# Altium schematic sheet [01] Power Supply.SchDoc
size A4
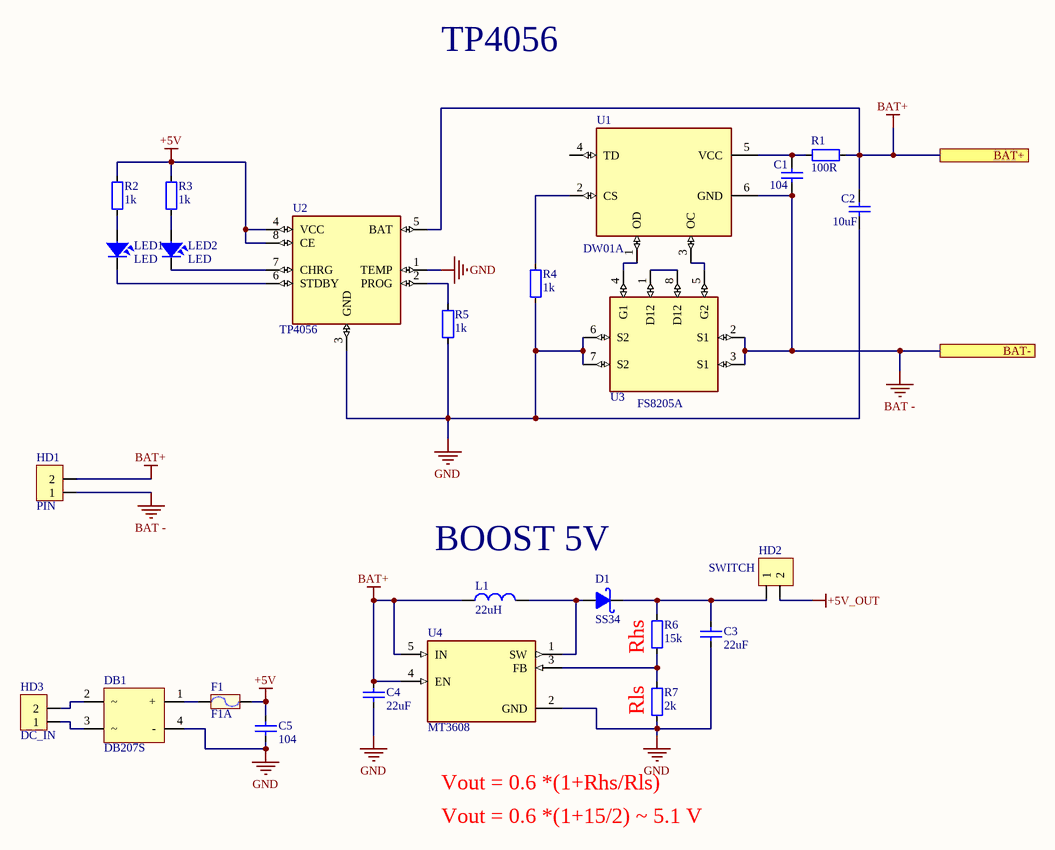
[diagram p0: [01] Power Supply.SchDoc]

## Parts
C1  104  [CAP_0805]
C2  10uF  [CAP_0805]
C3  22uF  [CAP_1206]
C4  22uF  [CAP_1206]
C5  104  [CAP_0805]
D1  SS34  [DO-214AA]
DB1  DB207S  [DB207S]
F1  F1A  [RES-SMD-1812]
HD1  PIN  [HED2T]
HD2  SWITCH  [HED2T]
HD3  DC_IN  [HED2T]
L1  22uH  [CD75-220]
LED1  LED  [LED-0805-Green]
LED2  LED  [LED-0805-Red]
R1  100R  [RES-SMD-0805]
R2  1k  [RES-SMD-0805]
R3  1k  [RES-SMD-0805]
R4  1k  [RES-SMD-0805]
R5  1k  [RES-SMD-0805]
R6  15k  [RES-SMD-0805]
R7  2k  [RES-SMD-0805]
U1  DW01A  [SOT23-6]
U2  TP4056  [TP4056]
U3  FS8205A  [FS8205A]
U4  MT3608  [MT3608]

## Ports
BAT+, BAT-

## Nets
+5V: C5.2 F1.2 R2.2 R3.2 U2.4(VCC) U2.8(CE)
+5V_OUT: HD2.2
BAT -: C1.1 HD1.1 U1.6(GND) U3.2(S1) U3.3(S1) ; port BAT-
BAT+: C2.2 C4.2 HD1.2 L1.1 R1.1 U2.5(BAT) U4.4(EN) U4.5(IN) ; port BAT+
GND: C2.1 C3.1 C4.1 C5.1 DB1.4(-) R4.1 R5.1 R7.1 U2.1(TEMP) U2.3(GND) U3.6(S2) U3.7(S2) U4.2(GND)
NetC1_2: C1.2 R1.2 U1.5(VCC)
NetC3_2: C3.2 D1.2(K) HD2.1 R6.2
NetD1_1: D1.1(A) L1.2 U4.1(SW)
NetDB1_1: DB1.1(+) F1.1
NetDB1_2: DB1.2 HD3.2
NetDB1_3: DB1.3 HD3.1
NetLED1_1: LED1.1 R2.1
NetLED1_2: LED1.2 U2.6(STDBY)
NetLED2_1: LED2.1 R3.1
NetLED2_2: LED2.2 U2.7(CHRG)
NetR4_2: R4.2 U1.2(CS)
NetR5_2: R5.2 U2.2(PROG)
NetR6_1: R6.1 R7.2 U4.3(FB)
NetU1_1: U1.1(OD) U3.4(G1)
NetU1_3: U1.3(OC) U3.5(G2)
NetU3_1: U3.1(D12) U3.8(D12)

Not connected (* = marked no-connect by the designer): U1 4(TD)

## Notes on the sheet
- TP4056
- BOOST 5V
- (near R6) Rhs
- (near R7) Rls
- Vout = 0.6 *(1+Rhs/Rls)
- Vout = 0.6 *(1+15/2) ~ 5.1 V

## Library data of the parts
C1-C5 = CapSMD: Capacitor; Value: 33p; Published: 8-Jun-2000; LatestRevisionDate: 17-Jul-2002; LatestRevisionNote: Re-released for DXP Platform.; PackageReference: RAD-0.3; Publisher: Altium Limited
D1 = 1N5822: Schottky Rectifiers; Value: Diode c?m 1N5408
DB1 = Diode Bridge Flate: Diode Bridge
F1 = Fuse: Designed by: VanDungEvn; Value: Fuse
HD1-HD3 = Header2: Header IDC, 2 x 1 Pin Vertical 2.54mm Pitch (Non-Boxed, Male); Manufacturer: W¨¹rth Elektronik eiSos GmbH; partNo: 613002143121; ComponentLink1 Description: Manufacturer; ComponentLink2 Description: Datasheet; NoPins: 02; Created Date: 29 March 2013; ComponentLink1URL: http://www.we-online.com; ComponentLink2URL: http://katalog.we-online.de/em/datasheet/6130xx143121.pdf; Created by: Karrer Zheng
L1 = Inductor: Inductor 22uH CD75; Value: 150 mH
LED1 LED2 = LED: LED Single colour Green and Red; Value: LED 3 ly Single Colour
R1-R7 = Resistor - SMD: Resistor; Manufacturer: Generic Components; Class: Passive; Published: 08/06/2000; Publisher: Altium Hobart Technology Centre
U1 = DW01A: One Cell Lithium-ion/Polymer Battery Protection IC
U2 = TP4056: Complete single cell Li-Ion battery with a constant current / constant voltage linear charger
U4 = MT3608: High Efficiency 1.2MHz 2A Step Up Converter